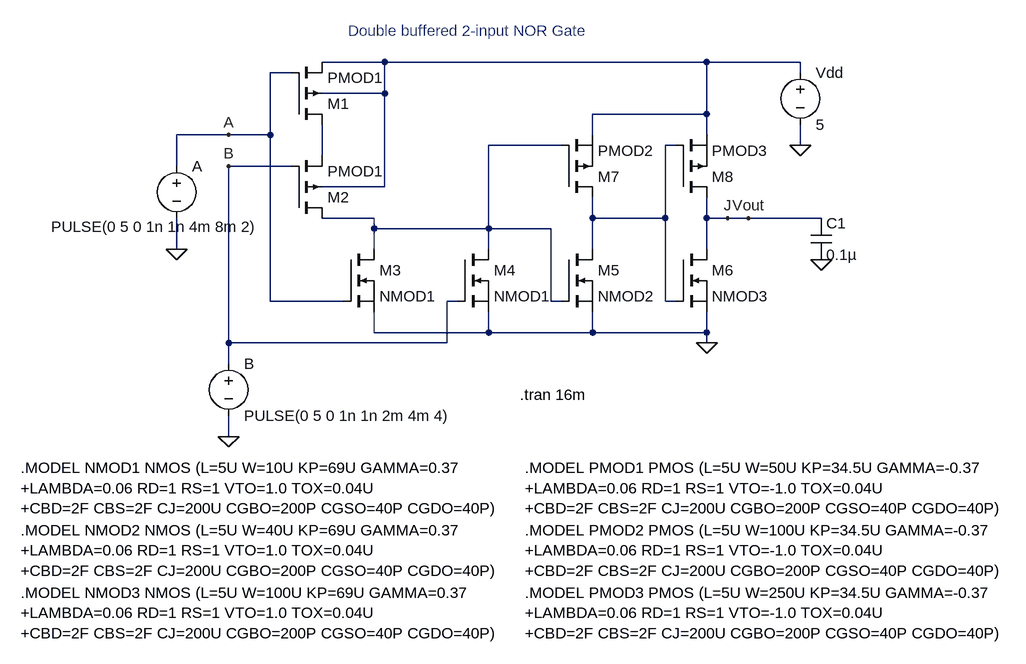
[diagram p0: schematic double_buf_2in_nor_3_4.asc]
double_buf_2in_nor_3_4.asc, the LTspice schematic file:
Version 4
SHEET 1 1972 912
WIRE 592 -112 496 -112
WIRE 1088 -112 592 -112
WIRE 1232 -112 1088 -112
WIRE 448 -96 416 -96
WIRE 1232 -96 1232 -112
WIRE 592 -64 592 -112
WIRE 592 -64 496 -64
WIRE 1088 -32 1088 -112
WIRE 1088 -32 912 -32
WIRE 352 0 272 0
WIRE 416 0 416 -96
WIRE 416 0 352 0
WIRE 912 0 912 -32
WIRE 1088 0 1088 -32
WIRE 864 16 752 16
WIRE 1040 16 1024 16
WIRE 1232 16 1232 -16
WIRE 496 32 496 -16
WIRE 272 48 272 0
WIRE 448 48 352 48
WIRE 592 80 592 -64
WIRE 592 80 496 80
WIRE 576 128 496 128
WIRE 912 128 912 96
WIRE 1024 128 1024 16
WIRE 1024 128 912 128
WIRE 1088 128 1088 96
WIRE 1120 128 1088 128
WIRE 1152 128 1120 128
WIRE 1264 128 1152 128
WIRE 576 144 576 128
WIRE 752 144 752 16
WIRE 752 144 576 144
WIRE 848 144 752 144
WIRE 272 176 272 128
WIRE 576 176 576 144
WIRE 752 176 752 144
WIRE 912 176 912 128
WIRE 1088 176 1088 128
WIRE 416 256 416 0
WIRE 528 256 416 256
WIRE 704 256 688 256
WIRE 848 256 848 144
WIRE 864 256 848 256
WIRE 1024 256 1024 128
WIRE 1040 256 1024 256
WIRE 576 304 576 272
WIRE 752 304 752 272
WIRE 752 304 576 304
WIRE 912 304 912 272
WIRE 912 304 752 304
WIRE 1088 304 1088 272
WIRE 1088 304 912 304
WIRE 352 320 352 48
WIRE 688 320 688 256
WIRE 688 320 352 320
WIRE 1088 320 1088 304
WIRE 352 352 352 320
WIRE 352 464 352 432
FLAG 1152 128 Vout
FLAG 272 176 0
FLAG 352 464 0
FLAG 1088 320 0
FLAG 352 0 A
FLAG 352 48 B
FLAG 1120 128 J
FLAG 1232 16 0
FLAG 1264 192 0
SYMBOL voltage 272 32 R0
WINDOW 3 -193 109 Left 2
WINDOW 123 0 0 Left 0
WINDOW 39 0 0 Left 0
SYMATTR Value PULSE(0 5 0 1n 1n 4m 8m 2)
SYMATTR InstName A
SYMBOL voltage 352 336 R0
WINDOW 123 0 0 Left 0
WINDOW 39 0 0 Left 0
SYMATTR InstName B
SYMATTR Value PULSE(0 5 0 1n 1n 2m 4m 4)
SYMBOL nmos 528 176 R0
SYMATTR InstName M3
SYMATTR Value NMOD1
SYMBOL nmos 704 176 R0
SYMATTR InstName M4
SYMATTR Value NMOD1
SYMBOL nmos 864 176 R0
SYMATTR InstName M5
SYMATTR Value NMOD2
SYMBOL nmos 1040 176 R0
SYMATTR InstName M6
SYMATTR Value NMOD3
SYMBOL pmos 864 96 M180
SYMATTR InstName M7
SYMATTR Value PMOD2
SYMBOL pmos 1040 96 M180
SYMATTR InstName M8
SYMATTR Value PMOD3
SYMBOL pmos4 448 -16 M180
SYMATTR InstName M1
SYMATTR Value PMOD1
SYMBOL pmos4 448 128 M180
SYMATTR InstName M2
SYMATTR Value PMOD1
SYMBOL voltage 1232 -112 R0
SYMATTR InstName Vdd
SYMATTR Value 5
SYMBOL cap 1248 128 R0
SYMATTR InstName C1
SYMATTR Value 0.1µ
TEXT 536 -160 Left 2 ;Double buffered 2-input NOR Gate
TEXT 32 512 Left 2 !.MODEL NMOD1 NMOS (L=5U W=10U KP=69U GAMMA=0.37\n+LAMBDA=0.06 RD=1 RS=1 VTO=1.0 TOX=0.04U\n+CBD=2F CBS=2F CJ=200U CGBO=200P CGSO=40P CGDO=40P)
TEXT 32 608 Left 2 !.MODEL NMOD2 NMOS (L=5U W=40U KP=69U GAMMA=0.37\n+LAMBDA=0.06 RD=1 RS=1 VTO=1.0 TOX=0.04U\n+CBD=2F CBS=2F CJ=200U CGBO=200P CGSO=40P CGDO=40P)
TEXT 32 704 Left 2 !.MODEL NMOD3 NMOS (L=5U W=100U KP=69U GAMMA=0.37\n+LAMBDA=0.06 RD=1 RS=1 VTO=1.0 TOX=0.04U\n+CBD=2F CBS=2F CJ=200U CGBO=200P CGSO=40P CGDO=40P)
TEXT 808 512 Left 2 !.MODEL PMOD1 PMOS (L=5U W=50U KP=34.5U GAMMA=-0.37\n+LAMBDA=0.06 RD=1 RS=1 VTO=-1.0 TOX=0.04U\n+CBD=2F CBS=2F CJ=200U CGBO=200P CGSO=40P CGDO=40P)
TEXT 808 608 Left 2 !.MODEL PMOD2 PMOS (L=5U W=100U KP=34.5U GAMMA=-0.37\n+LAMBDA=0.06 RD=1 RS=1 VTO=-1.0 TOX=0.04U\n+CBD=2F CBS=2F CJ=200U CGBO=200P CGSO=40P CGDO=40P)
TEXT 808 704 Left 2 !.MODEL PMOD3 PMOS (L=5U W=250U KP=34.5U GAMMA=-0.37\n+LAMBDA=0.06 RD=1 RS=1 VTO=-1.0 TOX=0.04U\n+CBD=2F CBS=2F CJ=200U CGBO=200P CGSO=40P CGDO=40P)
TEXT 800 400 Left 2 !.tran 16m

The netlist it stands for:
* double_buf_2in_nor_3_4.asc
V§A A 0 PULSE(0 5 0 1n 1n 4m 8m 2)
V§B B 0 PULSE(0 5 0 1n 1n 2m 4m 4)
M3 N002 A 0 0 NMOD1
M4 N002 B 0 0 NMOD1
M5 N003 N002 0 0 NMOD2
M6 J N003 0 0 NMOD3
M7 N003 N002 N001 N001 PMOD2
M8 J N003 N001 N001 PMOD3
M1 N004 A N001 N001 PMOD1
M2 N002 B N004 N001 PMOD1
Vdd N001 0 5
C1 J 0 0.1µ
.model NMOS NMOS
.model PMOS PMOS
.lib standard.mos
* Double buffered 2-input NOR Gate
.MODEL NMOD1 NMOS (L=5U W=10U KP=69U GAMMA=0.37
+LAMBDA=0.06 RD=1 RS=1 VTO=1.0 TOX=0.04U
+CBD=2F CBS=2F CJ=200U CGBO=200P CGSO=40P CGDO=40P)
.MODEL NMOD2 NMOS (L=5U W=40U KP=69U GAMMA=0.37
+LAMBDA=0.06 RD=1 RS=1 VTO=1.0 TOX=0.04U
+CBD=2F CBS=2F CJ=200U CGBO=200P CGSO=40P CGDO=40P)
.MODEL NMOD3 NMOS (L=5U W=100U KP=69U GAMMA=0.37
+LAMBDA=0.06 RD=1 RS=1 VTO=1.0 TOX=0.04U
+CBD=2F CBS=2F CJ=200U CGBO=200P CGSO=40P CGDO=40P)
.MODEL PMOD1 PMOS (L=5U W=50U KP=34.5U GAMMA=-0.37
+LAMBDA=0.06 RD=1 RS=1 VTO=-1.0 TOX=0.04U
+CBD=2F CBS=2F CJ=200U CGBO=200P CGSO=40P CGDO=40P)
.MODEL PMOD2 PMOS (L=5U W=100U KP=34.5U GAMMA=-0.37
+LAMBDA=0.06 RD=1 RS=1 VTO=-1.0 TOX=0.04U
+CBD=2F CBS=2F CJ=200U CGBO=200P CGSO=40P CGDO=40P)
.MODEL PMOD3 PMOS (L=5U W=250U KP=34.5U GAMMA=-0.37
+LAMBDA=0.06 RD=1 RS=1 VTO=-1.0 TOX=0.04U
+CBD=2F CBS=2F CJ=200U CGBO=200P CGSO=40P CGDO=40P)
.tran 16m
.backanno
.end